# EasyEDA Pro project ProPrj_PCB_2025-05-19.epro, board PCB1_1
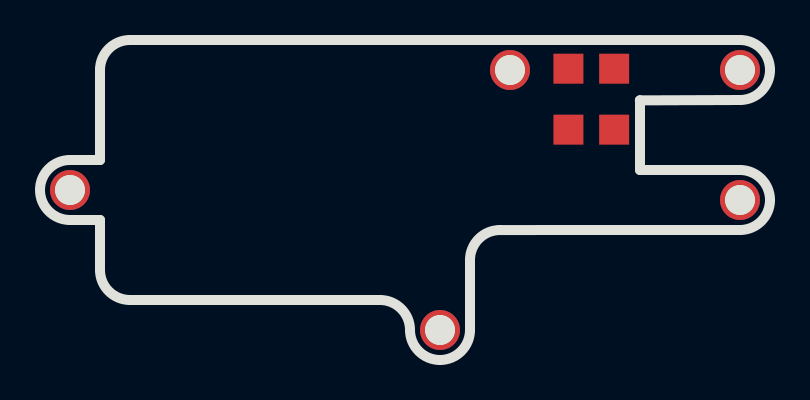
[diagram p10: board, top side]
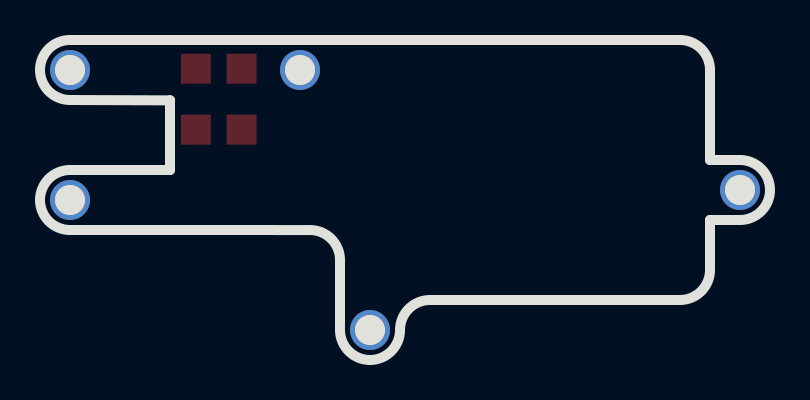
[diagram p11: board, bottom side, seen from below]

Outline 36.5 x 16 mm; copper layers: Top Layer, Bottom Layer. Coordinates in mm from the lower left corner of the outline.
Outline path: 3,14.5 3,10 1.5,10 arc(0,8.5) 1.5,7 3,7 3,4.5 arc(3.44,3.44) 4.5,3 17,3 arc(18.06,2.56) 18.5,1.5 arc(18.94,0.44) 20,0 arc(21.06,0.44) 21.5,1.5 21.5,5 arc(21.94,6.06) 23,6.5 35,6.5 arc(36.06,6.94) 36.5,8 arc(36.06,9.06) 35,9.5 30,9.5 30,12.98 ; 3,14.5 arc(3.44,15.56) 4.5,16 35,16 arc(36.06,15.56) 36.5,14.5 arc(36.06,13.44) 35,13 30,12.98 ; 3,14.5 arc(3,14.5) 3,14.5 ; 30,12.98 29.99,12.98 ; 35,14.5 arc(35,14.5) 35,14.5 35,14.5 ; 35,8 arc(35,8) 35,8 35,8
Stack: Top Layer 0.035mm / Dielectric1 1.51mm FR4 er 4.5 / Bottom Layer 0.035mm

## Design rules (mm)
template: 自定义配置
spacing copperThickness1oz (default): track to track 0.102, other pairs 0.152 to 0.3
spacing copperThickness2oz: track to track 0.203, other pairs 0.152 to 0.3
track width copperThickness1oz (default): min 0.127, default 0.254, max 2.54
track width copperThickness2oz: min 0.203, default 0.254, max 2.54
differential pair differentialPair (default): width min 0.127, default 0.254, max 2.54; gap min 0.152, default 0.152
via viaSize (default): diameter min 0.5, default 0.61, max 10; hole min 0.3, default 0.305, max 6.3

## Placement (name value [footprint] x y rotation side)
NOREF  -  [Pad_e105]  35 8 180 top
NOREF#2  -  [Pad_e17]  20 1.5 180 top
NOREF#3  -  [Pad_e5]  26.42 14.56 270 top
NOREF#4  -  [Pad_e3]  28.71 11.52 270 top
NOREF#5  -  [Pad_e260]  35 14.5 180 top
NOREF#6  -  [Pad_e2]  26.42 11.52 270 top
NOREF#7  -  [Pad_e4]  28.71 14.56 270 top
NOREF#8  -  [Pad_e6]  1.5 8.5 180 top
NOREF#9  -  [Pad_e99]  23.5 14.5 180 top

## Footprints (pads in the part's own frame, mm; a bottom-side part is the same pattern mirrored in y, then rotated)
Pad_e2
  rect 1.5x1.5 smd: 1(0,0)
Pad_e3
  rect 1.5x1.5 smd: 1(0,0)
Pad_e4
  rect 1.5x1.5 smd: 1(0,0)
Pad_e5
  rect 1.5x1.5 smd: 1(0,0)
Pad_e6
  round 2 hole 1.5: 1(0,0)
Pad_e17
  round 2 hole 1.5: 1(0,0)
Pad_e99
  round 2 hole 1.5: 1(0,0)
Pad_e105
  round 2 hole 1.5: 1(0,0)
Pad_e260
  round 2 hole 1.5: 1(0,0)

## Nets
GND: NOREF.1 NOREF#2.1 NOREF#5.1 NOREF#8.1 NOREF#9.1
A+: NOREF#3.1
A-: NOREF#7.1
B+: NOREF#6.1
B-: NOREF#4.1
